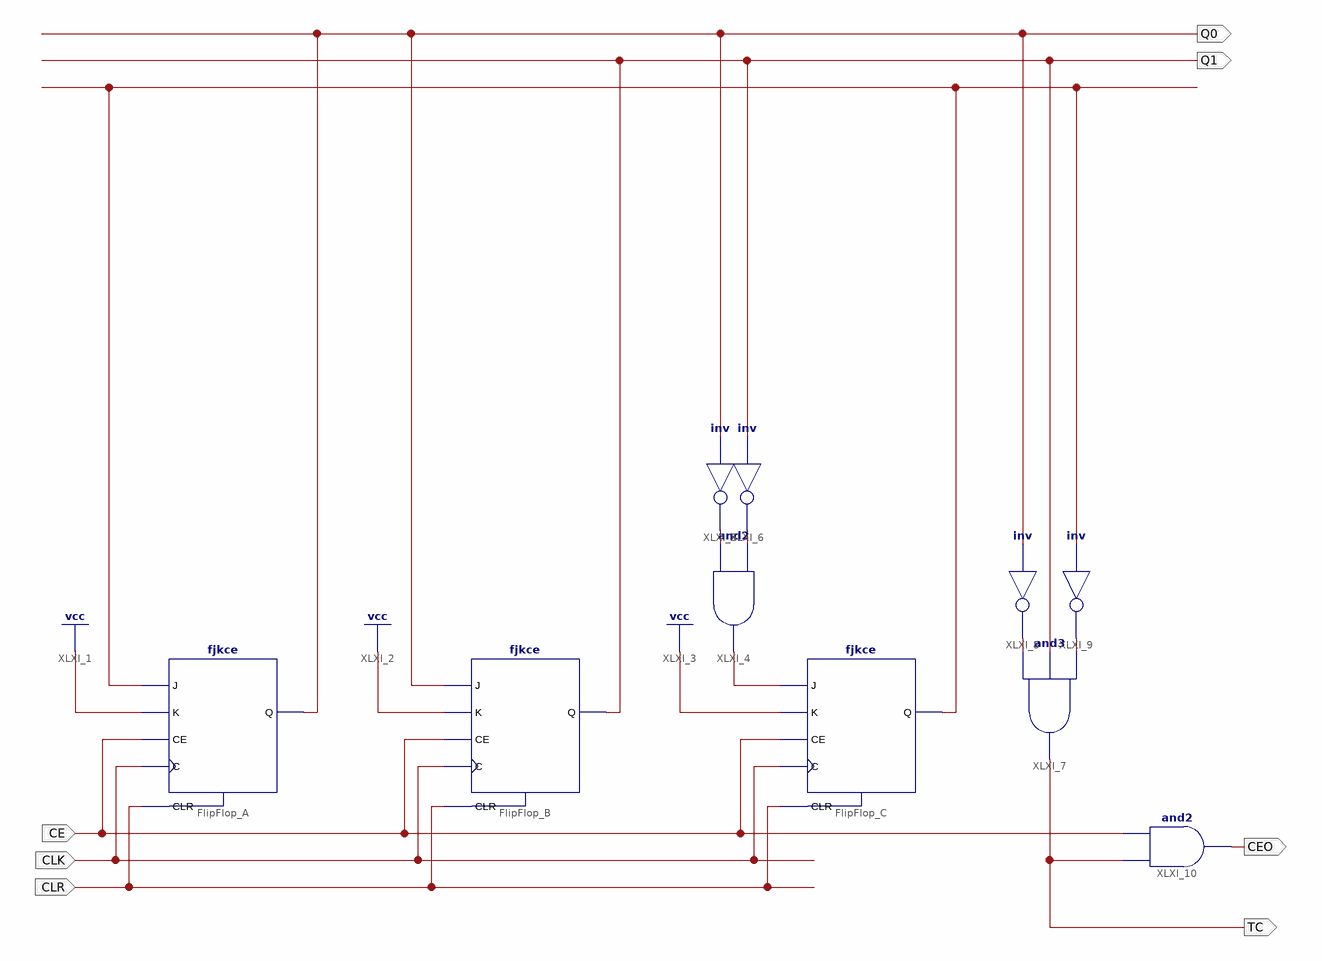
[diagram p0: schematic sheet 1]
// Xilinx ISE schematic counters1.sch (spartan6) as structural Verilog: 10 symbols, 7 ports
module counters1 (
  input  CE,
  input  CLK,
  input  CLR,
  output CEO,
  output TC,
  output Q0,
  output Q1
);

  wire Q2, XLXN_4, XLXN_5, XLXN_6, XLXN_7, XLXN_8;

  fjkce FlipFlop_A (.C(CLK), .CE(CE), .CLR(CLR), .J(Q2), .K(1'b1), .Q(Q0));
  fjkce FlipFlop_B (.C(CLK), .CE(CE), .CLR(CLR), .J(Q0), .K(1'b1), .Q(Q1));
  and XLXI_4 (XLXN_4, XLXN_5, XLXN_6);
  not XLXI_5 (XLXN_5, Q0);
  not XLXI_6 (XLXN_6, Q1);
  fjkce FlipFlop_C (.C(CLK), .CE(CE), .CLR(CLR), .J(XLXN_4), .K(1'b1), .Q(Q2));
  and XLXI_7 (TC, XLXN_7, Q1, XLXN_8);
  not XLXI_8 (XLXN_7, Q0);
  not XLXI_9 (XLXN_8, Q2);
  and XLXI_10 (CEO, CE, TC);
endmodule
